# Altium project AERServoBoard_342.PrjPcb
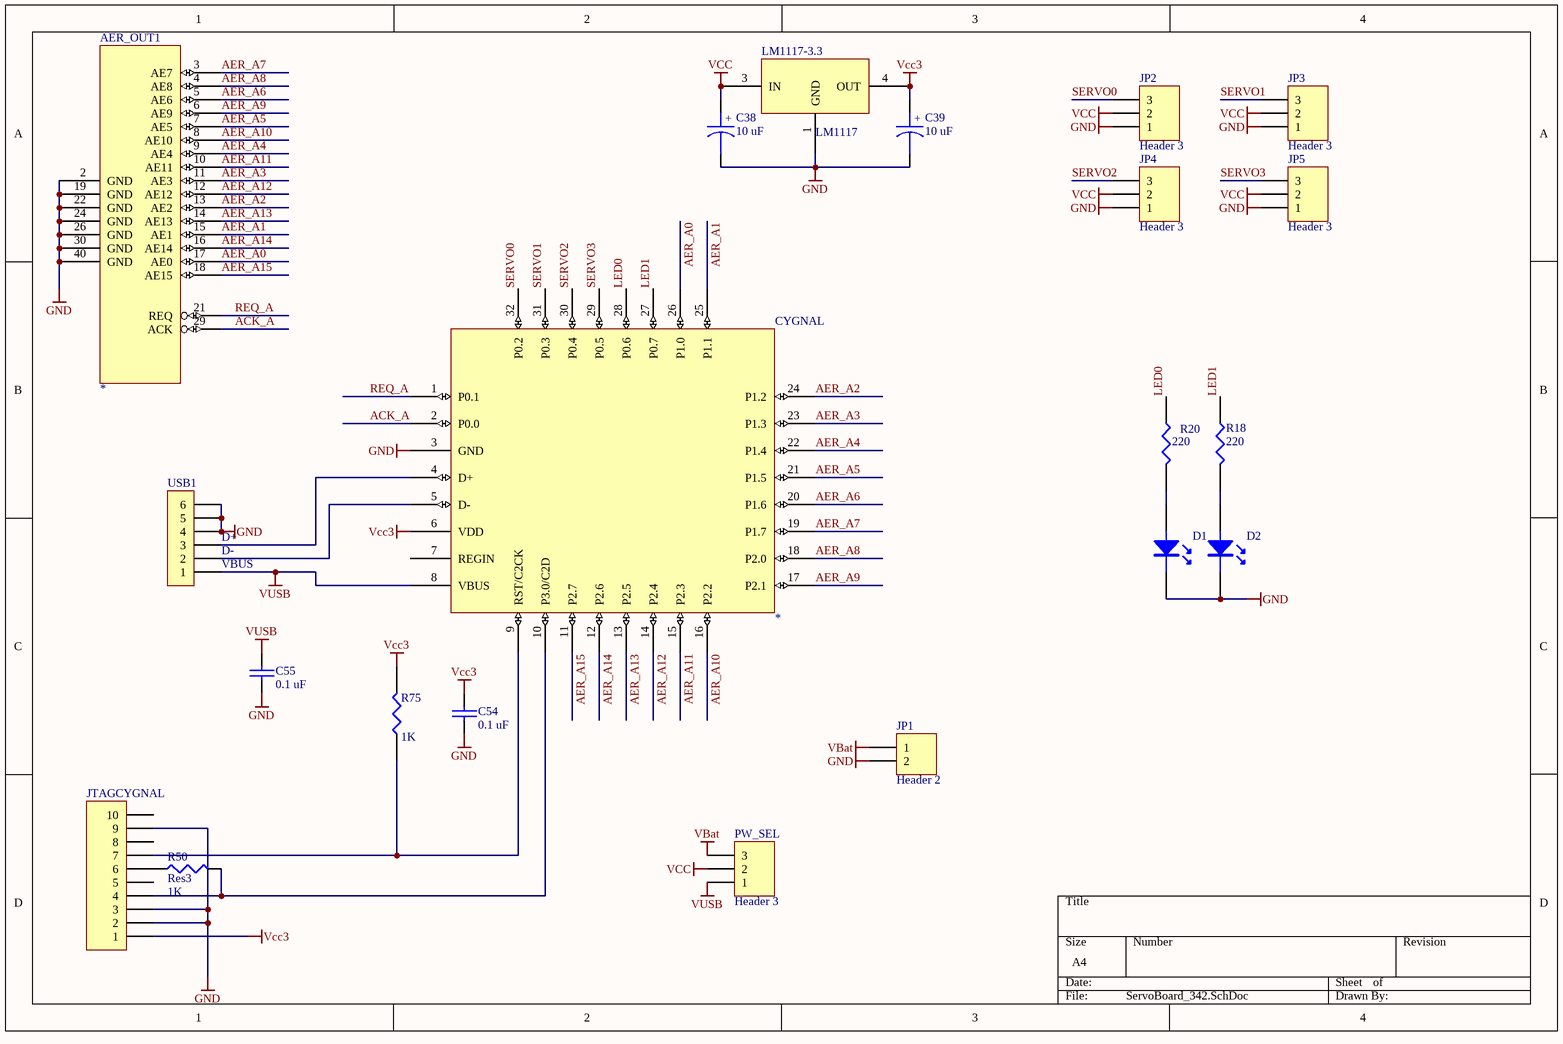
[diagram p0: ServoBoard_342.SchDoc]
1 sheet, 21 parts. Net scope: global (net labels, ports and power ports of the same name join across sheets).
Board file: ServoBoard_342.PcbDoc

## Sheet ServoBoard_342.SchDoc
size A4

### Parts
AER_OUT1  *  [IDC-40]
C38  10 uF  [Minitantalo]
C39  10 uF  [Minitantalo]
C54  0.1 uF  [CAP 10]
C55  0.1 uF  [CAP 10]
CYGNAL  *  [LQFP-32]
D1  (no value)  [LED]
D2  (no value)  [LED]
JP1  Header 2  [HDR1X2]
JP2  Header 3  [HDR1X3]
JP3  Header 3  [HDR1X3]
JP4  Header 3  [HDR1X3]
JP5  Header 3  [HDR1X3]
JTAGCYGNAL  (no value)  [IDC-10]
LM1117-3.3  LM1117  [DSO-G3/D6.7]
PW_SEL  Header 3  [HDR1X3]
R18  220  [1608[0603]]
R20  220  [1608[0603]]
R50  Res3  value 1K  [C1608-0603]
R75  1K  [C1608-0603]
USB1  (no value)  [USB_CON]

### Nets
GND: AER_OUT1.2(GND) AER_OUT1.19(GND) AER_OUT1.22(GND) AER_OUT1.24(GND) AER_OUT1.26(GND) AER_OUT1.30(GND) AER_OUT1.40(GND) C38.2 C39.2 C54.2 C55.2 CYGNAL.3(GND) D1.K D2.K JP1.2 JP2.1 JP3.1 JP4.1 JP5.1 JTAGCYGNAL.2 JTAGCYGNAL.3 JTAGCYGNAL.9 LM1117-3.3.1(GND) USB1.4 USB1.5 USB1.6
VBat: JP1.1 PW_SEL.3
VCC: C38.1 JP2.2 JP3.2 JP4.2 JP5.2 LM1117-3.3.3(IN) PW_SEL.2
Vcc3: C39.1 C54.1 CYGNAL.6(VDD) JTAGCYGNAL.1 LM1117-3.3.4(OUT) R75.2
VUSB: C55.1 CYGNAL.8(VBUS) PW_SEL.1 USB1.1
ACK_A: AER_OUT1.29(ACK) CYGNAL.2(P0.0)
AER_A0: AER_OUT1.17(AE0) CYGNAL.26(P1.0)
AER_A1: AER_OUT1.15(AE1) CYGNAL.25(P1.1)
AER_A2: AER_OUT1.13(AE2) CYGNAL.24(P1.2)
AER_A3: AER_OUT1.11(AE3) CYGNAL.23(P1.3)
AER_A4: AER_OUT1.9(AE4) CYGNAL.22(P1.4)
AER_A5: AER_OUT1.7(AE5) CYGNAL.21(P1.5)
AER_A6: AER_OUT1.5(AE6) CYGNAL.20(P1.6)
AER_A7: AER_OUT1.3(AE7) CYGNAL.19(P1.7)
AER_A8: AER_OUT1.4(AE8) CYGNAL.18(P2.0)
AER_A9: AER_OUT1.6(AE9) CYGNAL.17(P2.1)
AER_A10: AER_OUT1.8(AE10) CYGNAL.16(P2.2)
AER_A11: AER_OUT1.10(AE11) CYGNAL.15(P2.3)
AER_A12: AER_OUT1.12(AE12) CYGNAL.14(P2.4)
AER_A13: AER_OUT1.14(AE13) CYGNAL.13(P2.5)
AER_A14: AER_OUT1.16(AE14) CYGNAL.12(P2.6)
AER_A15: AER_OUT1.18(AE15) CYGNAL.11(P2.7)
LED0: CYGNAL.28(P0.6) R20.1
LED1: CYGNAL.27(P0.7) R18.1
REQ_A: AER_OUT1.21(REQ) CYGNAL.1(P0.1)
SERVO0: CYGNAL.32(P0.2) JP2.3
SERVO1: CYGNAL.31(P0.3) JP3.3
SERVO2: CYGNAL.30(P0.4) JP4.3
SERVO3: CYGNAL.29(P0.5) JP5.3
NetCYGNAL_4: CYGNAL.4(D+) USB1.3
NetCYGNAL_5: CYGNAL.5(D-) USB1.2
NetCYGNAL_9: CYGNAL.9(RST/C2CK) JTAGCYGNAL.7 R75.1
NetCYGNAL_10: CYGNAL.10(P3.0/C2D) JTAGCYGNAL.4 R50.2
NetD1_A: D1.A R20.2
NetD2_A: D2.A R18.2
NetJTAGCYGNAL_6: JTAGCYGNAL.6 R50.1

Not connected (* = marked no-connect by the designer): CYGNAL 7(REGIN); JTAGCYGNAL 5 8 10

### Notes on the sheet
- (near USB1) VBUS
- (near USB1) D-
- (near USB1) D+
- (in symbol CAPACITOR POL) +

### Library data of the parts
AER_OUT1 = CON_AER1
C38 C39 = CAPACITOR POL: Capacitor
C54 C55 = CAP: Capacitor
CYGNAL = C8051F320
D1 D2 = LED
JP1 = Header 2: Header, 2-Pin; LatestRevisionDate: 17-Jul-2002; LatestRevisionNote: Re-released for DXP Platform.; Publisher: Altium Limited
JP2-JP5 PW_SEL = Header 3: Header, 3-Pin; Revision: 17-Jul-2002: Re-released for DXP Platform.; Publisher: Altium Limited
JTAGCYGNAL = CON10: Connector
R18 R20 R75 = RES1
R50 = Res3: Resistor; Published: 8-Jun-2000; Revision: July-2002: Re-released for DXP Platform.; Publisher: Altium Limited
USB1 = CON6: Connector